# Altium schematic sheet Sheet2.SchDoc
size A3; SheetNumber: 2; SheetTotal: 4
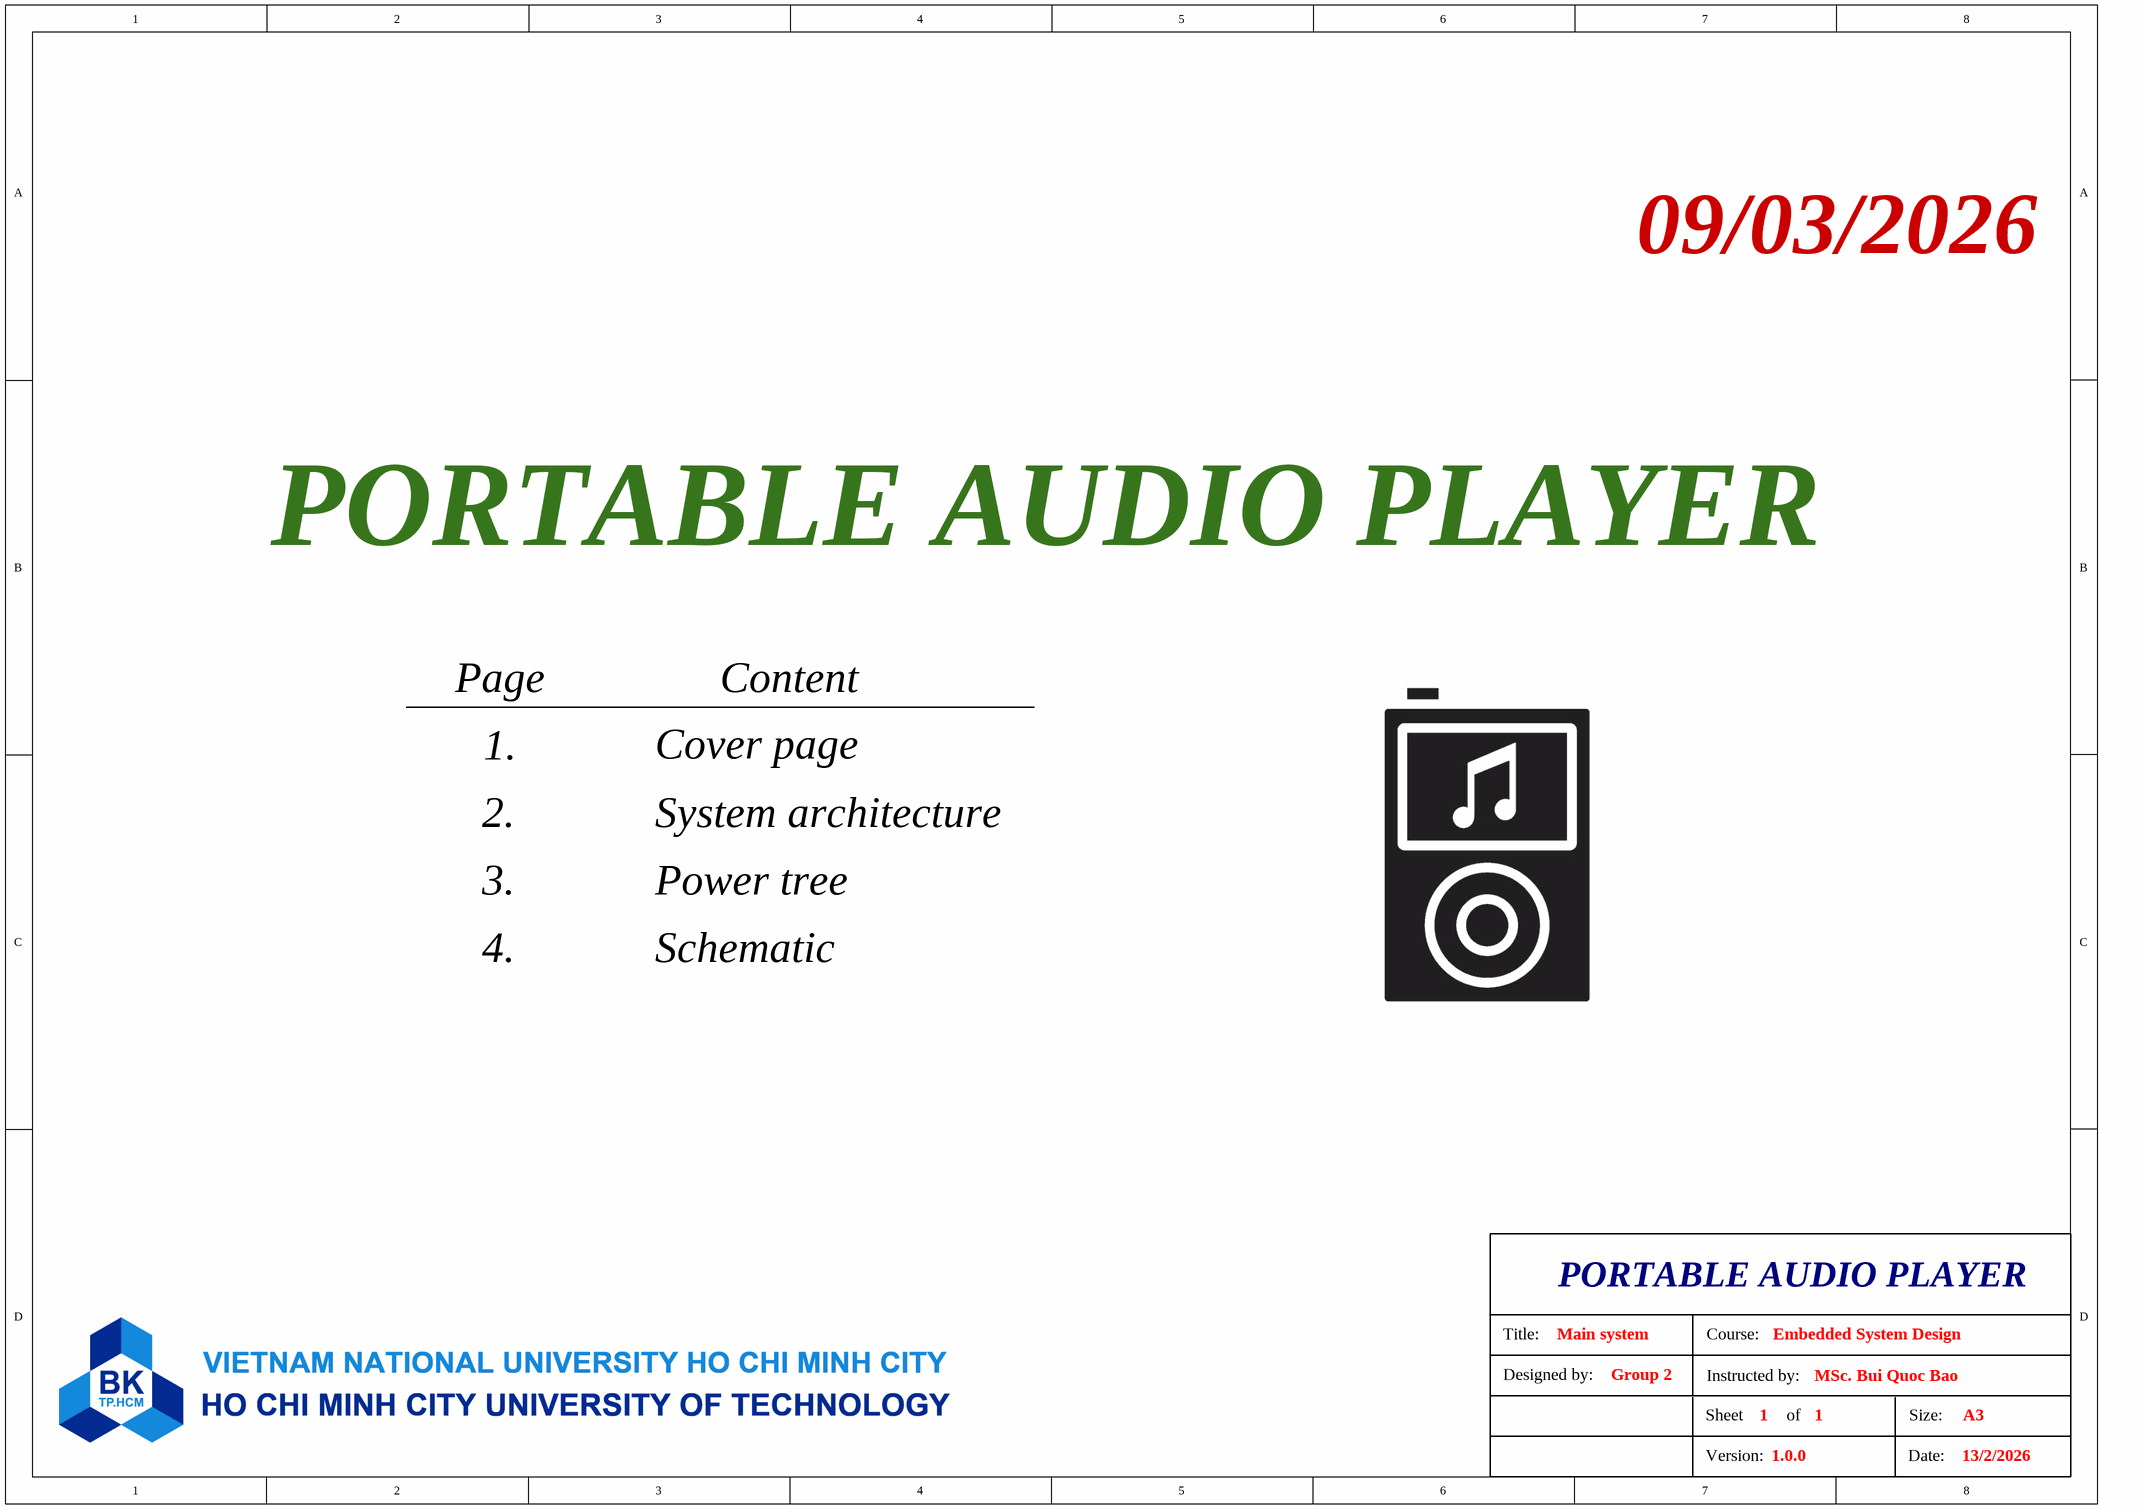
[diagram p0: Sheet2.SchDoc]

## Notes on the sheet
- 09/03/2026
- PORTABLE AUDIO PLAYER
- Page
- Content
- 1.
- Cover page
- 2.
- System architecture
- 3.
- Power tree
- 4.
- Schematic
- Designed by:
- Title:
- Main system
- Group 2
- Instructed by:
- Course:
- Embedded System Design
- MSc. Bui Quoc Bao
- Version:
- Sheet
- 1
- 1.0.0
- of
- Date:
- Size:
- 13/2/2026
- A3